# EAGLE schematic bf2_redraw (EAGLE 8.5.1)
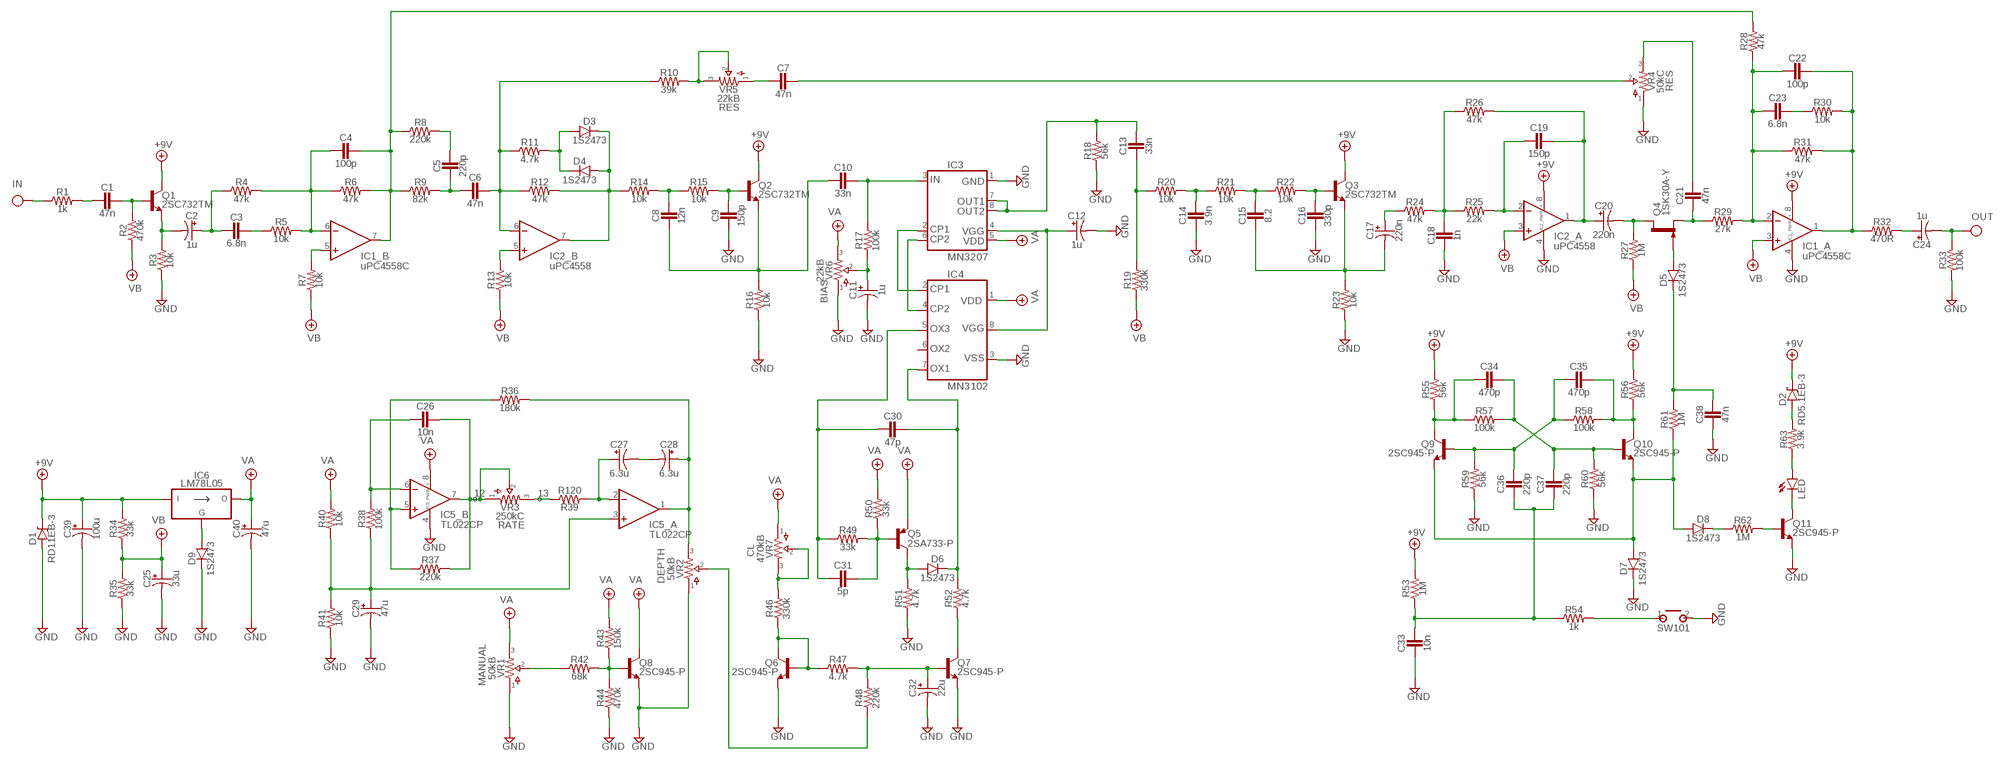
[diagram p0: schematic, sheet 1]

## Parts
C1  47n  CER/FILMBOX.1  [BOX_SMALL]
C2  1u  0400  [040_020]
C3  6.8n  CER/FILMBOX.1  [BOX_SMALL]
C4  100p  CER/FILMBOX.1  [BOX_SMALL]
C5  220p  CER/FILMBOX.1  [BOX_SMALL]
C6  47n  CER/FILMBOX.1  [BOX_SMALL]
C7  47n  CER/FILMBOX.1  [BOX_SMALL]
C8  12n  CER/FILMBOX.1  [BOX_SMALL]
C9  150p  CER/FILMBOX.1  [BOX_SMALL]
C10  33n  CER/FILMBOX.1  [BOX_SMALL]
C11  1u  0400  [040_020]
C12  1u  0400  [040_020]
C13  33n  CER/FILMBOX.1  [BOX_SMALL]
C14  3.9n  CER/FILMBOX.1  [BOX_SMALL]
C15  8.2  CER/FILMBOX.1  [BOX_SMALL]
C16  330p  CER/FILMBOX.1  [BOX_SMALL]
C17  220n  0400  [040_020]
C18  1n  CER/FILMBOX.1  [BOX_SMALL]
C19  150p  CER/FILMBOX.1  [BOX_SMALL]
C20  220n  0400  [040_020]
C21  47n  CER/FILMBOX.1  [BOX_SMALL]
C22  100p  CER/FILMBOX.1  [BOX_SMALL]
C23  6.8n  CER/FILMBOX.1  [BOX_SMALL]
C24  1u  0400  [040_020]
C25  33u  0400  [040_020]
C26  10n  CER/FILMBOX.1  [BOX_SMALL]
C27  6.3u  0400  [040_020]
C28  6.3u  0400  [040_020]
C29  47u  0400  [040_020]
C30  47p  CER/FILMBOX.1  [BOX_SMALL]
C31  5p  CER/FILMBOX.1  [BOX_SMALL]
C32  22u  0400  [040_020]
C33  10n  CER/FILMBOX.1  [BOX_SMALL]
C34  470p  CER/FILMBOX.1  [BOX_SMALL]
C35  470p  CER/FILMBOX.1  [BOX_SMALL]
C36  220p  CER/FILMBOX.1  [BOX_SMALL]
C37  220p  CER/FILMBOX.1  [BOX_SMALL]
C38  47n  CER/FILMBOX.1  [BOX_SMALL]
C39  100u  0400  [040_020]
C40  47u  0400  [040_020]
D1  RD11EB-3  ZENER.2  [DO41-2]
D2  RD5.1EB-3  ZENER.2  [DO41-2]
D3  1S2473  DO35.2  [DO35-2]
D4  1S2473  DO35.2  [DO35-2]
D5  1S2473  DO35.2  [DO35-2]
D6  1S2473  DO35.2  [DO35-2]
D7  1S2473  DO35.2  [DO35-2]
D8  1S2473  DO35.2  [DO35-2]
D9  1S2473  DO35.2  [DO35-2]
IC1  uPC4558C  DUALTH  [DIL0]
IC2  uPC4558  DUALTH  [DIL0]
IC3  MN3207  BL3208  [DIL0]
IC4  MN3102  CLOCK  [DIL8]
IC5  TL022CP  DUALTH  [DIL0]
IC6  LM78L05  [TO92-]
LED  SLP1358  LED  [3MM_D]
Q1  2SC732TM  2SC828A  [TO92-]
Q2  2SC732TM  2SC828A  [TO92-]
Q3  2SC732TM  2SC828A  [TO92-]
Q4  1SK30A-Y  2N3819TO-92S  [TO92-]
Q5  2SA733-P  2N3906-  [TO92-]
Q6  2SC945-P  2SC828A  [TO92-]
Q7  2SC945-P  2SC828A  [TO92-]
Q8  2SC945-P  2SC828A  [TO92-]
Q9  2SC945-P  2SC828A  [TO92-]
Q10  2SC945-P  2SC828A  [TO92-]
Q11  2SC945-P  2SC828A  [TO92-]
R1  1k  R_.3B  [R0207/3]
R2  470k  R_.3B  [R0207/3]
R3  10k  R_.3B  [R0207/3]
R4  47k  R_.3B  [R0207/3]
R5  10k  R_.3B  [R0207/3]
R6  47k  R_.3B  [R0207/3]
R7  10k  R_.3B  [R0207/3]
R8  220k  R_.3B  [R0207/3]
R9  82k  R_.3B  [R0207/3]
R10  39k  R_.3B  [R0207/3]
R11  4.7k  R_.3B  [R0207/3]
R12  47k  R_.3B  [R0207/3]
R13  10k  R_.3B  [R0207/3]
R14  10k  R_.3B  [R0207/3]
R15  10k  R_.3B  [R0207/3]
R16  10k  R_.3B  [R0207/3]
R17  100k  R_.3B  [R0207/3]
R18  56k  R_.3B  [R0207/3]
R19  330k  R_.3B  [R0207/3]
R20  10k  R_.3B  [R0207/3]
R21  10k  R_.3B  [R0207/3]
R22  10k  R_.3B  [R0207/3]
R23  10k  R_.3B  [R0207/3]
R24  47k  R_.3B  [R0207/3]
R25  22k  R_.3B  [R0207/3]
R26  47k  R_.3B  [R0207/3]
R27  1M  R_.3B  [R0207/3]
R28  47k  R_.3B  [R0207/3]
R29  27k  R_.3B  [R0207/3]
R30  10k  R_.3B  [R0207/3]
R31  47k  R_.3B  [R0207/3]
R32  470R  R_.3B  [R0207/3]
R33  100k  R_.3B  [R0207/3]
R34  33k  R_.3B  [R0207/3]
R35  33k  R_.3B  [R0207/3]
R36  180k  R_.3B  [R0207/3]
R37  220k  R_.3B  [R0207/3]
R38  100k  R_.3B  [R0207/3]
R40  10k  R_.3B  [R0207/3]
R41  10k  R_.3B  [R0207/3]
R42  68k  R_.3B  [R0207/3]
R43  150k  R_.3B  [R0207/3]
R44  470k  R_.3B  [R0207/3]
R46  330k  R_.3B  [R0207/3]
R47  4.7k  R_.3B  [R0207/3]
R48  220k  R_.3B  [R0207/3]
R49  33k  R_.3B  [R0207/3]
R50  33k  R_.3B  [R0207/3]
R51  4.7k  R_.3B  [R0207/3]
R52  4.7k  R_.3B  [R0207/3]
R53  1M  R_.3B  [R0207/3]
R54  1k  R_.3B  [R0207/3]
R55  56k  R_.3B  [R0207/3]
R56  56k  R_.3B  [R0207/3]
R57  100k  R_.3B  [R0207/3]
R58  100k  R_.3B  [R0207/3]
R59  56k  R_.3B  [R0207/3]
R60  56k  R_.3B  [R0207/3]
R61  1M  R_.3B  [R0207/3]
R62  1M  R_.3B  [R0207/3]
R63  3.9k  R_.3B  [R0207/3]
R120  R39  R_.3B  [R0207/3]
SW101  MOMENTARY  [SPST]
VR1  50kB  POTS16MM  [16MM]
VR2  50kB  POTS16MM  [16MM]
VR3  250kC  POTS16MM  [16MM]
VR4  50kC  POTS16MM  [16MM]
VR5  22kB  POTS16MM  [16MM]
VR6  22kB  POTS16MM  [16MM]
VR7  470kB  POTS16MM  [16MM]

## Nets
+9V: C39.+ D1.C D2.C IC1.8(_PWR:V+) IC2.8(_PWR:V+) IC6.1(VI) Q1.2(C) Q2.2(C) Q3.2(C) R34.2 R53.2 R55.2 R56.2
GND: C9.2 C11.- C12.- C14.2 C16.2 C18.2 C25.- C29.- C32.- C33.2 C38.2 C39.- C40.- D1.A D7.C D9.C IC1.4(_PWR:V-) IC2.4(_PWR:V-) IC3.1 IC4.3 IC5.4(_PWR:V-) Q6.3(E) Q7.3(E) Q8.3(E) Q11.3(E) R3.1 R16.1 R18.1 R23.1 R33.2 R35.1 R41.1 R44.1 R51.1 R59.1 R60.1 SW101.2(S) VR1.1 VR2.1 VR4.1 VR6.1
IN: R1.1
N$3: C1.2 R1.2
N$4: C1.1 Q1.1(B) R2.2
N$5: C12.+ IC3.4 IC4.8
N$7: C2.- Q1.3(E) R3.2
N$8: C2.+ C3.2 R4.1
N$9: C3.1 R5.1
N$10: C4.2 IC1.6(_B:-IN) R4.2 R5.2 R6.1
N$11: IC1.5(_B:+IN) R7.2
N$12: C4.1 IC1.7(_B:OUT) R6.2 R8.1 R9.1 R28.2
N$13: C5.1 R8.2
N$14: C5.2 C6.2 R9.2
N$15: IC2.5(_B:+IN) R13.2
N$16: C6.1 IC2.6(_B:-IN) R10.1 R11.1 R12.1
N$17: D3.A D4.C R11.2
N$18: D3.C D4.A IC2.7(_B:OUT) R12.2 R14.1
N$19: C8.1 R14.2 R15.1
N$20: C9.1 Q2.1(B) R15.2
N$21: C8.2 C10.2 Q2.3(E) R16.2
N$22: D9.A IC6.2(GND)
N$23: C13.1 IC3.7 IC3.8 R18.2
N$24: C11.+ R17.1 VR6.2
N$25: C10.1 IC3.3 R17.2
N$26: IC3.2 IC4.2
N$29: C34.2 Q9.2(C) R55.1 R57.1
N$31: C35.1 Q10.2(C) R56.1 R58.2
N$32: C35.2 C36.1 Q9.1(B) R58.1 R59.2
N$33: IC3.6 IC4.4
N$34: C34.1 C37.1 Q10.1(B) R57.2 R60.2
N$35: LED.P$1(C) Q11.2(C)
N$36: C33.1 C36.2 C37.2 R53.1 R54.1
N$37: D7.A D8.A Q9.3(E) Q10.3(E) R61.1
N$38: D5.A Q4.2(G)
N$39: C38.1 D5.C R61.2
N$40: C17.+ R24.1
N$41: C13.2 R19.2 R20.1
N$42: LED.ANODE(A) R63.1
N$43: D2.A R63.2
N$44: C14.1 R20.2 R21.1
N$45: C15.1 R21.2 R22.1
N$46: C16.1 Q3.1(B) R22.2
N$47: C15.2 C17.- Q3.3(E) R23.2
N$48: C18.1 R24.2 R25.1 R26.1
N$49: C19.2 IC2.2(_A:-IN) R25.2
N$50: C19.1 C20.+ IC2.1(_A:OUT) R26.2
N$51: C22.2 C23.2 IC1.2(_A:-IN) R28.1 R29.2 R31.1
N$52: C21.2 Q4.1(S) R29.1
N$53: C20.- Q4.3(D) R27.2
N$54: C22.1 IC1.1(_A:OUT) R30.2 R31.2 R32.1
N$55: C24.+ R32.2
N$57: C23.1 R30.1
N$58: R10.2 VR5.2 VR5.3
N$59: C7.2 VR5.1
N$60: C21.1 VR4.3
N$61: C7.1 VR4.2
N$62: C31.1 Q5.2(B) R49.2 R50.1
N$63: D6.A Q5.1(C) R51.2
N$64: C30.1 D6.C IC4.7 R52.2
N$65: C30.2 C31.2 IC4.5 R49.1
N$66: Q7.2(C) R52.1
N$67: R46.2 VR7.2 VR7.3
N$68: Q6.1(B) Q6.2(C) R46.1 R47.1
N$69: C32.+ Q7.1(B) R47.2 R48.2
N$70: C26.2 IC5.6(_B:-IN) R38.2
N$71: C29.+ IC5.3(_A:+IN) R38.1 R40.1 R41.2
N$72: C26.1 IC5.7(_B:OUT) R37.2 VR3.1 VR3.2
N$73: R120.1 VR3.3
N$74: IC5.5(_B:+IN) R36.1 R37.1
N$75: C27.+ IC5.2(_A:-IN) R120.2
N$76: C28.+ IC5.1(_A:OUT) R36.2 VR2.3
N$77: C27.- C28.-
N$78: R48.1 VR2.2
N$79: D8.C R62.1
N$80: Q8.1(B) R42.2 R43.1 R44.2
N$81: R42.1 VR1.2
N$82: Q11.1(B) R62.2
N$85: R54.2 SW101.1(P)
OUT: C24.- R33.1
VA: C40.+ IC3.5 IC4.1 IC5.8(_PWR:V+) IC6.3(VO) Q5.3(E) Q8.2(C) R40.2 R43.2 R50.2 VR1.3 VR6.3 VR7.1
VB: C25.+ IC1.3(_A:+IN) IC2.3(_A:+IN) R2.1 R7.1 R13.1 R19.1 R27.1 R34.1 R35.2
Unconnected: IC4.6

## Notes on the sheet
- RES
- RES
- BIAS
- 12 | 13
- RATE
- CL
- DEPTH
- MANUAL

## Library data of the parts
C1 C3-C10 C13-C16 C18 C19 C21-C23 C26 C30 C31 C33-C38 = pedals-capacitors-film:CER/FILM: 47 - 120pF Xicon Ceramic Disc 2.5mm lead spacing
C2 C11 C12 C17 C20 C24 C25 C27-C29 C32 C39 C40 = pedals-capacitors-elec:040
D1 D2 = pedals-diodes:ZENER
D3-D9 = pedals-diodes:DO35: DO-35 Package Diodes: 1N914
IC1 IC2 IC5 = pedals-integrated circuits:DUAL: OP AMP
IC3 = pedals-integrated circuits:BL3208
IC4 = pedals-integrated circuits:CLOCK
IC6 = pedals-regulators:LM78L05
LED = pedals-diodes:LED
Q1-Q3 Q6-Q11 = pedals-transistors:2SC828A
Q4 = pedals-transistors:2N3819: N-CHANNEL FET
Q5 = pedals-transistors:2N3906: PNP Transistor
R1-R38 R40-R44 R46-R63 R120 = pedals-resistors:R_
SW101 = pedals-switches:MOMENTARY
VR1-VR7 = pedals-potentiometers:POTS